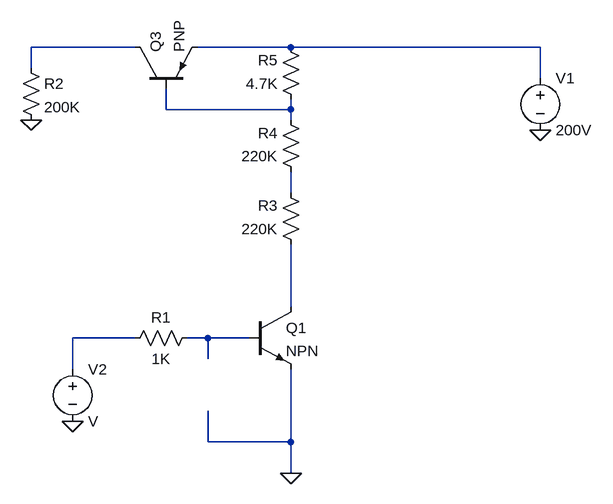
[diagram p0: schematic pnp_shifter.asc]
pnp_shifter.asc, the LTspice schematic file:
Version 4
SHEET 1 900 680
WIRE 192 -320 32 -320
WIRE 432 -320 288 -320
WIRE 816 -320 432 -320
WIRE 32 -288 32 -320
WIRE 816 -272 816 -320
WIRE 240 -224 240 -256
WIRE 432 -224 432 -240
WIRE 432 -224 240 -224
WIRE 432 -208 432 -224
WIRE 432 -96 432 -128
WIRE 432 80 432 -16
WIRE 192 128 96 128
WIRE 304 128 272 128
WIRE 368 128 304 128
WIRE 304 160 304 128
WIRE 96 176 96 128
WIRE 304 288 304 240
WIRE 432 288 432 176
WIRE 432 288 304 288
WIRE 432 336 432 288
FLAG 432 336 0
FLAG 816 -192 0
FLAG 96 256 0
FLAG 32 -208 0
SYMBOL res 288 112 R90
WINDOW 0 0 56 VBottom 2
WINDOW 3 32 56 VTop 2
SYMATTR InstName R1
SYMATTR Value 1K
SYMBOL res 448 0 R180
WINDOW 0 36 76 Left 2
WINDOW 3 36 40 Left 2
SYMATTR InstName R3
SYMATTR Value 220K
SYMBOL res 448 -112 R180
WINDOW 0 36 76 Left 2
WINDOW 3 36 40 Left 2
SYMATTR InstName R4
SYMATTR Value 220K
SYMBOL res 448 -224 R180
WINDOW 0 36 76 Left 2
WINDOW 3 36 40 Left 2
SYMATTR InstName R5
SYMATTR Value 4.7K
SYMBOL npn 368 80 R0
SYMATTR InstName Q1
SYMBOL pnp 192 -256 R270
SYMATTR InstName Q3
SYMBOL voltage 816 -288 R0
WINDOW 123 0 0 Left 2
WINDOW 39 0 0 Left 2
SYMATTR InstName V1
SYMATTR Value 200V
SYMBOL voltage 96 160 R0
SYMATTR InstName V2
SYMBOL res 16 -304 R0
SYMATTR InstName R2
SYMATTR Value 200K

The netlist it stands for:
* pnp_shifter.asc
R1 N007 N006 1K
R3 N005 N004 220K
R4 N004 N003 220K
R5 N003 N002 4.7K
Q1 N005 N007 0 0 NPN
Q3 N001 N003 N002 0 PNP
V1 N002 0 200V
V2 N006 0 V
R2 N001 0 200K
.model NPN NPN
.model PNP PNP
.lib standard.bjt
.backanno
.end